# EAGLE design Scheme (EAGLE 9.6.2)
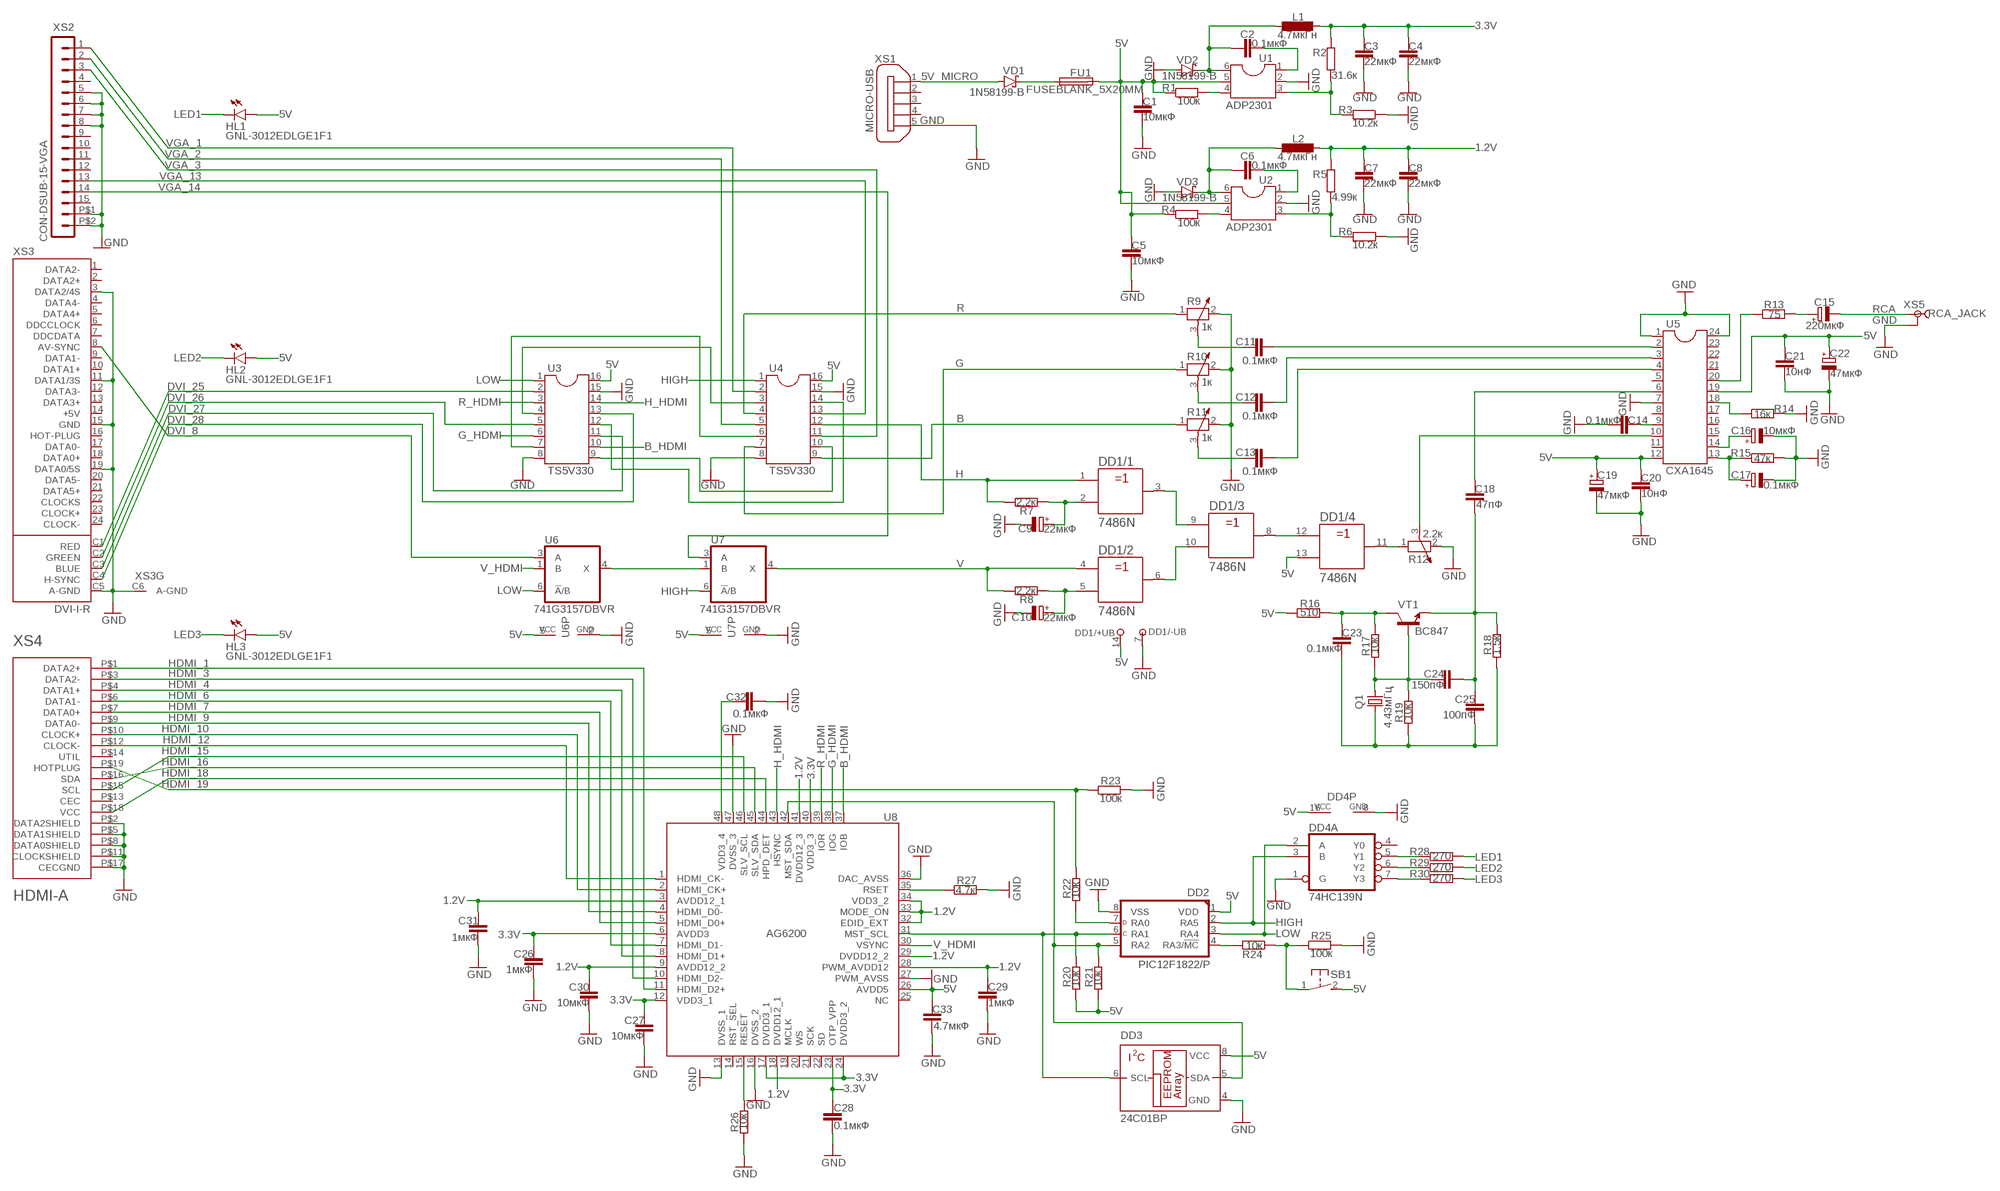
[diagram p0: schematic, sheet 1]

## Parts
C1  10мкФ  C-EUC0603  [C0603]
C2  0.1мкФ  C-EUC1206  [C1206]
C3  22мкФ  C-EUC1206  [C1206]
C4  22мкФ  C-EUC1206  [C1206]
C5  10мкФ  C-EUC0603  [C0603]
C6  0.1мкФ  C-EUC1206  [C1206]
C7  22мкФ  C-EUC1206  [C1206]
C8  22мкФ  C-EUC1206  [C1206]
C9  22мкФ  CPOL-EUE2,5-6E  [E2,5-6E]
C10  22мкФ  CPOL-EUE2,5-6E  [E2,5-6E]
C11  0.1мкФ  C-EUC1206  [C1206]
C12  0.1мкФ  C-EUC1206  [C1206]
C13  0.1мкФ  C-EUC1206  [C1206]
C14  0.1мкФ  C-EUC1206  [C1206]
C15  220мкФ  CPOL-EUE2,5-6E  [E2,5-6E]
C16  10мкФ  CPOL-EUE2,5-6E  [E2,5-6E]
C17  0.1мкФ  CPOL-EUE2,5-6E  [E2,5-6E]
C18  47пФ  C-EUC0603  [C0603]
C19  47мкФ  CPOL-EUE2,5-6E  [E2,5-6E]
C20  10нФ  C-EUC0603  [C0603]
C21  10нФ  C-EUC0603  [C0603]
C22  47мкФ  CPOL-EUE2,5-6E  [E2,5-6E]
C23  0.1мкФ  C-EUC1206  [C1206]
C24  150пФ  C-EUC0805  [C0805]
C25  100пФ  C-EUC0805  [C0805]
C26  1мкФ  C-EUC0603  [C0603]
C27  10мкФ  C-EUC0603  [C0603]
C28  0.1мкФ  C-EUC1206  [C1206]
C29  1мкФ  C-EUC0603  [C0603]
C30  10мкФ  C-EUC0603  [C0603]
C31  1мкФ  C-EUC0603  [C0603]
C32  0.1мкФ  C-EUC1206  [C1206]
C33  4.7мкФ  C-EUC0805  [C0805]
DD1  7486N  [DIL14]
DD2  PIC12F1822/P  [DIL8-P]
DD3  24C01BP  [DIL8]
DD4  74HC139N  [DIL16]
FU1  FUSEBLANK_5X20MM  [FUSE_HOLDER_5X20MM]
HL1  GNL-3012EDLGE1F1  [PLCC2]
HL2  GNL-3012EDLGE1F1  [PLCC2]
HL3  GNL-3012EDLGE1F1  [PLCC2]
L1  4.7мкГн  L-EUPIS2816  [PIS2816]
L2  4.7мкГн  L-EUPIS2816  [PIS2816]
Q1  4.43мГц  CRYSTALHC49U-V  [HC49U-V]
R1  100к  R-EU_R2512  [R2512]
R2  31.6к  R-EU_R0805  [R0805]
R3  10.2к  R-EU_R0805  [R0805]
R4  100к  R-EU_R2512  [R2512]
R5  4.99к  R-EU_R0805  [R0805]
R6  10.2к  R-EU_R0805  [R0805]
R7  2.2к  R-EU_R0402  [R0402]
R8  2.2к  R-EU_R0402  [R0402]
R9  1к  POTENTIOMETER_PT-10  [PT-10]
R10  1к  POTENTIOMETER_PT-10  [PT-10]
R11  1к  POTENTIOMETER_PT-10  [PT-10]
R12  2.2к  POTENTIOMETER_PT-10  [PT-10]
R13  75  R-EU_R0402  [R0402]
R14  16к  R-EU_R0402  [R0402]
R15  47к  R-EU_R0402  [R0402]
R16  510  R-EU_R0402  [R0402]
R17  10к  R-EU_R0805  [R0805]
R18  1.5к  R-EU_R0402  [R0402]
R19  10к  R-EU_R0805  [R0805]
R20  10к  R-EU_R0805  [R0805]
R21  10к  R-EU_R0805  [R0805]
R22  10к  R-EU_R0805  [R0805]
R23  100к  R-EU_R2512  [R2512]
R24  10к  R-EU_R0805  [R0805]
R25  100к  R-EU_R2512  [R2512]
R26  10к  R-EU_R0805  [R0805]
R27  4.7к  R-EU_R0402  [R0402]
R28  270  R-EU_R0402  [R0402]
R29  270  R-EU_R0402  [R0402]
R30  270  R-EU_R0402  [R0402]
SB1  31-XX  [B3F-31XX]
U1  ADP2301  DIL6  [DIL06]
U2  ADP2301  DIL6  [DIL06]
U3  TS5V330  DIL16  [DIL16]
U4  TS5V330  DIL16  [DIL16]
U5  CXA1645  DIL24-4  [DIL24-4]
U6  741G3157DBVR  [DBV_R-PDSO-G6]
U7  741G3157DBVR  [DBV_R-PDSO-G6]
U8  AG6200  [PLCC-48]
VD1  1N58199-B  [DO41-7.6]
VD2  1N58199-B  [DO41-7.6]
VD3  1N58199-B  [DO41-7.6]
VT1  BC847  BC847-NPN-SOT23-BEC  [SOT23-BEC]
XS1  MICRO-USB  [ZX62D-B-5PA8]
XS2  CON-DSUB-15-VGA  [181-015-212-171]
XS3  DVI-I-R  [DVI-I-R]
XS4  HDMI-A  [HDMI_A]
XS5  RCA_JACK  [TOBU3]

## Nets
1.2V: C7.1 C8.1 C29.1 C30.1 C31.1 L2.2 R5.2 U8.3(AVDD12_1) U8.9(AVDD12_2) U8.18(DVDD12_1) U8.28(PWM_AVDD12) U8.29(DVDD12_2) U8.32(EDID_EXT) U8.33(MODE_ON) U8.34(VDD3_2) U8.41(DVDD12_3)
3.3V: C3.1 C4.1 C26.1 C27.1 C28.1 L1.2 R2.2 U8.6(AVDD3) U8.12(VDD3_1) U8.17(DVDD3_1) U8.23(OTP_VPP) U8.24(DVDD3_2) U8.40(VDD3_3)
5V: C1.1 C5.1 C19.+ C20.1 C21.1 C22.+ C33.1 DD1.13(/4:B) DD1.14(/+UB:+UB) DD2.1(VDD) DD3.8(VCC) DD4.16(P:VCC) FU1.2 HL1.A HL2.A HL3.A R1.1 R4.1 R16.1 R20.1 R21.1 SB1.2(S) U1.5 U2.5 U3.16 U4.16 U5.12 U5.19 U6.5(VCC) U7.5(VCC) U8.26(AVDD5)
5V_MICRO: VD1.A XS1.1
B: R11.1 U4.9
B_HDMI: U3.10 U8.37(IOB)
DVI_8: U6.3(A) XS3.8(AV-SYNC)
DVI_25: U3.2 XS3.C1(RED)
DVI_26: U3.5 XS3.C2(GREEN)
DVI_27: U3.11 XS3.C3(BLUE)
DVI_28: U3.13 XS3.C4(H-SYNC)
G: R10.1 U4.7
G_HDMI: U3.6 U8.38(IOG)
GND: C1.2 C3.2 C4.2 C5.2 C7.2 C8.2 C9.- C10.- C14.2 C16.- C17.- C19.- C20.2 C21.2 C22.- C26.2 C27.2 C28.2 C29.2 C30.2 C31.2 C32.2 C33.2 DD1.7(/-UB:-UB) DD2.8(VSS) DD3.4(GND) DD4.1(A:G) DD4.8(P:GND) R3.1 R6.1 R9.2 R10.2 R11.2 R12.2 R14.2 R15.2 R23.2 R25.2 R26.1 R27.2 U1.2 U2.2 U3.8 U3.15 U4.8 U4.15 U5.1 U5.7 U5.24 U6.2(GND) U7.2(GND) U8.13(DVSS_1) U8.16(DVSS_2) U8.27(PWM_AVSS) U8.36(DAC_AVSS) U8.47(DVSS_3) VD2.A VD3.A XS1.5 XS2.5 XS2.6 XS2.7 XS2.8 XS2.P$1 XS2.P$2 XS3.3(DATA2/4S) XS3.11(DATA1/3S) XS3.15(GND) XS3.19(DATA0/5S) XS3.C5(A-GND) XS3.C6(A-GND) XS4.P$2(DATA2SHIELD) XS4.P$5(DATA1SHIELD) XS4.P$8(DATA0SHIELD) XS4.P$11(CLOCKSHIELD) XS4.P$17(CECGND) XS5.2 XS5.2@1 XS5.2@2
H: DD1.1(/1:A) R7.1 U4.12
H_HDMI: U3.14 U8.43(HSYNC)
HDMI_1: U8.11(HDMI_D2+) XS4.P$1(DATA2+)
HDMI_3: U8.10(HDMI_D2-) XS4.P$3(DATA2-)
HDMI_4: U8.8(HDMI_D1+) XS4.P$4(DATA1+)
HDMI_6: U8.7(HDMI_D1-) XS4.P$6(DATA1-)
HDMI_7: U8.5(HDMI_D0+) XS4.P$7(DATA0+)
HDMI_9: U8.4(HDMI_D0-) XS4.P$9(DATA0-)
HDMI_10: U8.2(HDMI_CK+) XS4.P$10(CLOCK+)
HDMI_12: U8.1(HDMI_CK-) XS4.P$12(CLOCK-)
HDMI_15: U8.46(SLV_SCL) XS4.P$15(SCL)
HDMI_16: U8.45(SLV_SDA) XS4.P$16(SDA)
HDMI_18: U8.44(HPD_DET) XS4.P$18(VCC)
HDMI_19: R22.2 R23.1 XS4.P$19(HOTPLUG)
HIGH: DD2.2(RA5) DD4.3(A:B) U4.1 U7.6(!A!/B)
LED1: HL1.C R28.2
LED2: HL2.C R29.2
LED3: HL3.C R30.2
LOW: DD2.3(RA4) DD4.2(A:A) U3.1 U6.6(!A!/B)
N$1: FU1.1 VD1.C
N$2: C9.+ DD1.2(/1:B) R7.2
N$3: C2.1 L1.1 U1.6 VD2.C
N$4: C10.+ DD1.5(/2:B) R8.2
N$5: C2.2 U1.1
N$6: R2.1 R3.2 U1.3
N$7: R1.2 U1.4
N$8: C6.1 L2.1 U2.6 VD3.C
N$9: C6.2 U2.1
N$10: R5.1 R6.2 U2.3
N$11: DD4.5(A:Y1) R28.1
N$12: R4.2 U2.4
N$13: C11.2 U5.2
N$14: DD1.3(/1:Y) DD1.9(/3:A)
N$15: DD1.6(/2:Y) DD1.10(/3:B)
N$16: C12.2 U5.3
N$17: DD1.8(/3:Y) DD1.12(/4:A)
N$18: DD1.11(/4:Y) R12.1
N$19: C11.1 R9.3
N$20: C12.1 R10.3
N$22: C13.1 R11.3
N$23: C13.2 U5.4
N$24: R12.3 U5.10
N$25: C23.1 R16.2 R17.2 VT1.C
N$26: C23.2 C25.2 Q1.2 R18.1 R19.1
N$27: C24.1 Q1.1 R17.1 R19.2 VT1.B
N$28: C18.2 C24.2 C25.1 R18.2 VT1.E
N$29: C18.1 U5.6
N$30: DD4.6(A:Y2) R29.1
N$31: C14.1 U5.9
N$32: DD4.7(A:Y3) R30.1
N$33: C17.+ R15.1 U5.13
N$34: C16.+ U5.14
N$35: R14.1 U5.18
N$36: R13.1 U5.20
N$37: U6.4(X) U7.1(B)
N$38: C15.+ R13.2
N$39: U3.4 U4.3
N$40: U3.7 U4.6
N$41: U3.9 U4.10
N$42: C32.1 U8.48(VDD3_4)
N$43: U3.12 U4.14
N$48: R26.2 U8.15(RESET)
N$49: R27.1 U8.35(RSET)
N$61: DD2.6(RA1) DD3.6(SCL) R20.2 U8.31(MST_SCL)
N$63: DD2.5(RA2) DD3.5(SDA) R21.2 U8.42(MST_SDA)
N$65: DD2.7(RA0) R22.1
N$68: DD2.4(RA3/!MC!) R24.2
N$69: R24.1 R25.1 SB1.1(P)
R: R9.1 U4.4
R_HDMI: U3.3 U8.39(IOR)
RCA: C15.- XS5.1
V: DD1.4(/2:A) R8.1 U7.4(X)
V_HDMI: U6.1(B) U8.30(VSYNC)
VGA_1: U4.2 XS2.1
VGA_2: U4.5 XS2.2
VGA_3: U4.11 XS2.3
VGA_13: U4.13 XS2.13
VGA_14: U7.3(A) XS2.14
Unconnected: DD4.4(A:Y0) DD4.9(B:Y3) DD4.10(B:Y2) DD4.11(B:Y1) DD4.12(B:Y0) DD4.13(B:B) DD4.14(B:A) DD4.15(B:G) U5.5 U5.8 U5.11 U5.15 U5.16 U5.17 U5.21 U5.22 U5.23 U8.14(RST_SEL) U8.19(MCLK) U8.20(WS) U8.21(SCK) U8.22(SD) U8.25(NC) XS1.2 XS1.3 XS1.4 XS1.S1 XS1.S2 XS1.S3 XS1.S4 XS2.4 XS2.9 XS2.10 XS2.11 XS2.12 XS2.15 XS3.1(DATA2-) XS3.2(DATA2+) XS3.4(DATA4-) XS3.5(DATA4+) XS3.6(DDCCLOCK) XS3.7(DDCDATA) XS3.9(DATA1-) XS3.10(DATA1+) XS3.12(DATA3-) XS3.13(DATA3+) XS3.16(HOT-PLUG) XS3.17(DATA0-) XS3.18(DATA0+) XS3.20(DATA5-) XS3.21(DATA5+) XS3.22(CLOCKS) XS3.23(CLOCK+) XS3.24(CLOCK-) XS4.P$13(CEC) XS4.P$14(UTIL)

## Power pins joined to a net without a drawn wire
+5V: XS3.14(+5V)

## Library data of the parts
C1-C8 C11-C14 C18 C20 C21 C23-C33 = kursach_final:C-EU: CAPACITOR, European symbol; SPICEPREFIX: C
C9 C10 C15-C17 C19 C22 = kursach_final:CPOL-EU: POLARIZED CAPACITOR, European symbol; SPICEPREFIX: C
DD1 = kursach_final:74*86: Quad 2-input EXCLUSIV-OR gate
DD2 = kursach_final:PIC12*F1822: Low pincount microcontroller http://www.microchip.com/wwwproducts/Devices.aspx?product=PIC12F1822 Properties Parameter Name Value Program Memory Type Flash Program Memory (KB) 3.5 CPU Speed (MIPS) 8 RAM Bytes 128 Data EEPROM (bytes) 256 Digital Communication Peripherals 1-UART, 1-A/E/USART, 1-SPI, 1-I2C1-MSSP(SPI/I2C) Capture/Compare/PWM Peripherals 1 ECCP / Timers 2 x 8-bit, 1 x 16-bit ADC 4 ch, 10-bit Comparators 1 Temperature Range (C) -40 to 125 Operating Voltage Range (V) 1.8 to 5.5 Pin Count 8 XLP Yes Cap Touch Channels 4 Features Enhanced Mid-range Core with 49 Instruction, 16 Stack Levels Flash Program Memory with self read/write capability Internal 32MHz oscillator Integrated Capacitive mTouch Sensing Module Data Signal Modulator Module MI2C, SPI, EUSART w/auto baud ECCP (Enhanced/Capture Compare PWM) Module Comparator with selectable Voltage Reference 4 Channel 10b ADC with Voltage Reference 25mA Source/Sink current I/O Two 8-bit Timers (TMR0/TMR2) One 16-bit Timer (TMR1) Extended Watchdog Timer (EWDT) Enhanced Power-On/Off-Reset Brown-Out Reset (BOR) In Circuit Serial Programming (ICSP) On Board In-Circuit Debug Wide Operating Voltage (1.8V – 5.5V) Low Power PIC12LF182x variants (1.8V – 3.6V) Standby Current (PIC12LF182X): 20 nA @ 1.8V, typical Active Current(PIC12LF1822): 50 uA/MHz @ 1.8V, typical Library from www.mikroelektroniikka.fi/lbr
DD3 = kursach_final:24C0*: Serial EEPROM 128 bit/1 K/2 K, I2C; MPN: AT24C01B-PU; OC_FARNELL: 1362637; OC_NEWARK: 50M3312
DD4 = kursach_final:74*139: Dual 2-line to 4-line DECODER/DEMULTIPLEXER
FU1 = kursach_final:FUSE: Fuse; OC_FARNELL: unknown; OC_NEWARK: unknown
HL1-HL3 = kursach_final:GNL-3012ED: LC TOPLED® Low Current LED Source: http://catalog.osram-os.com .. LG_LS_LY_T679_OBS.pdf; COLOR: green
L1 L2 = kursach_final:L-EU: INDUCTOR, European symbol; SPICEPREFIX: L
Q1 = kursach_final:CRYSTAL: CRYSTAL; OC_FARNELL: 1666969; OC_NEWARK: unknown
R1-R8 R13-R30 = kursach_final:R-EU_: RESISTOR, European symbol; SPICEPREFIX: R
R9-R12 = kursach_final:POTENTIOMETER_: Potentiometer; SPICEMODEL: POT; SPICEPREFIX: X
SB1 = kursach_final:31-XX: OMRON SWITCH; MPN: B3F-3100; OC_FARNELL: 959704; OC_NEWARK: 36M3582
U1 U2 = kursach_final:DIL6: Dual In Line / Socket
U3 U4 = kursach_final:DIL16: Dual In Line / Socket
U5 = kursach_final:DIL24: Dual In Line
U6 U7 = kursach_final:74*1G3157: Single-Pole, Double-Throw Analog Switch Source: http://focus.ti.com/lit/ds/symlink/sn74lvc1g3157.pdf
U8 = kursach_final:AG6200: ag6200; MPN: AD1953YSTZRL7; OC_FARNELL: unknown; OC_NEWARK: 12M8457
VD1-VD3 = kursach_final:1N5819: 1.0A SCHOTTKY BARRIER RECTIFIER Source: http://www.diodes.com/datasheets/ds23001.pdf
VT1 = kursach_final:*-NPN-: NPN Transistror
XS1 = kursach_final:MICRO-USB: Micro USB Type B Connector - Standard, Shell Through Hole Source: http://www.hirose.co.jp/cataloge_hp/ed_ZX_20140804.pdf; MF: Hirose; MPN: ZX62D-B-5PA8; OC_FARNELL: 2300438; OC_NEWARK: 69W0712
XS2 = kursach_final:CON-DSUB-15-VGA: NORCOMP's High Density 90° PC Mount D-Sub Connector 181 Series: SPECIFICATIONS: Contact Rating: 5 Amps Dielectric Strength: 1000V AC RMS Insulation Resistance: 1000 meg ohms Contact Material: Phosphor Bronze Contact Finish: Gold flash over Nickel Operating Temperature: -55°C to 150°C Shell Material: Steel, Tin Plated Insulations Material: Glass-Filled Polyester (UL94V-0) Gender: Receptacle (female) Please send any comments to: messi@users.sourceforge.net
XS3 = kursach_final:DVI-I-R: CONNECTOR MiroCross(TM)-DVI i/0 plug and receptacle connector system (scart)
XS4 = kursach_final:HDMI-A: Horizonal HDMI type "A" jack
XS5 = kursach_final:RCA_JACK: Female Cinch CONNECTOR ( RCA Jack ); MF: FARNELL; MPN: TOBU 3; OC_FARNELL: 592791; OC_NEWARK: 06WX5914

## Board
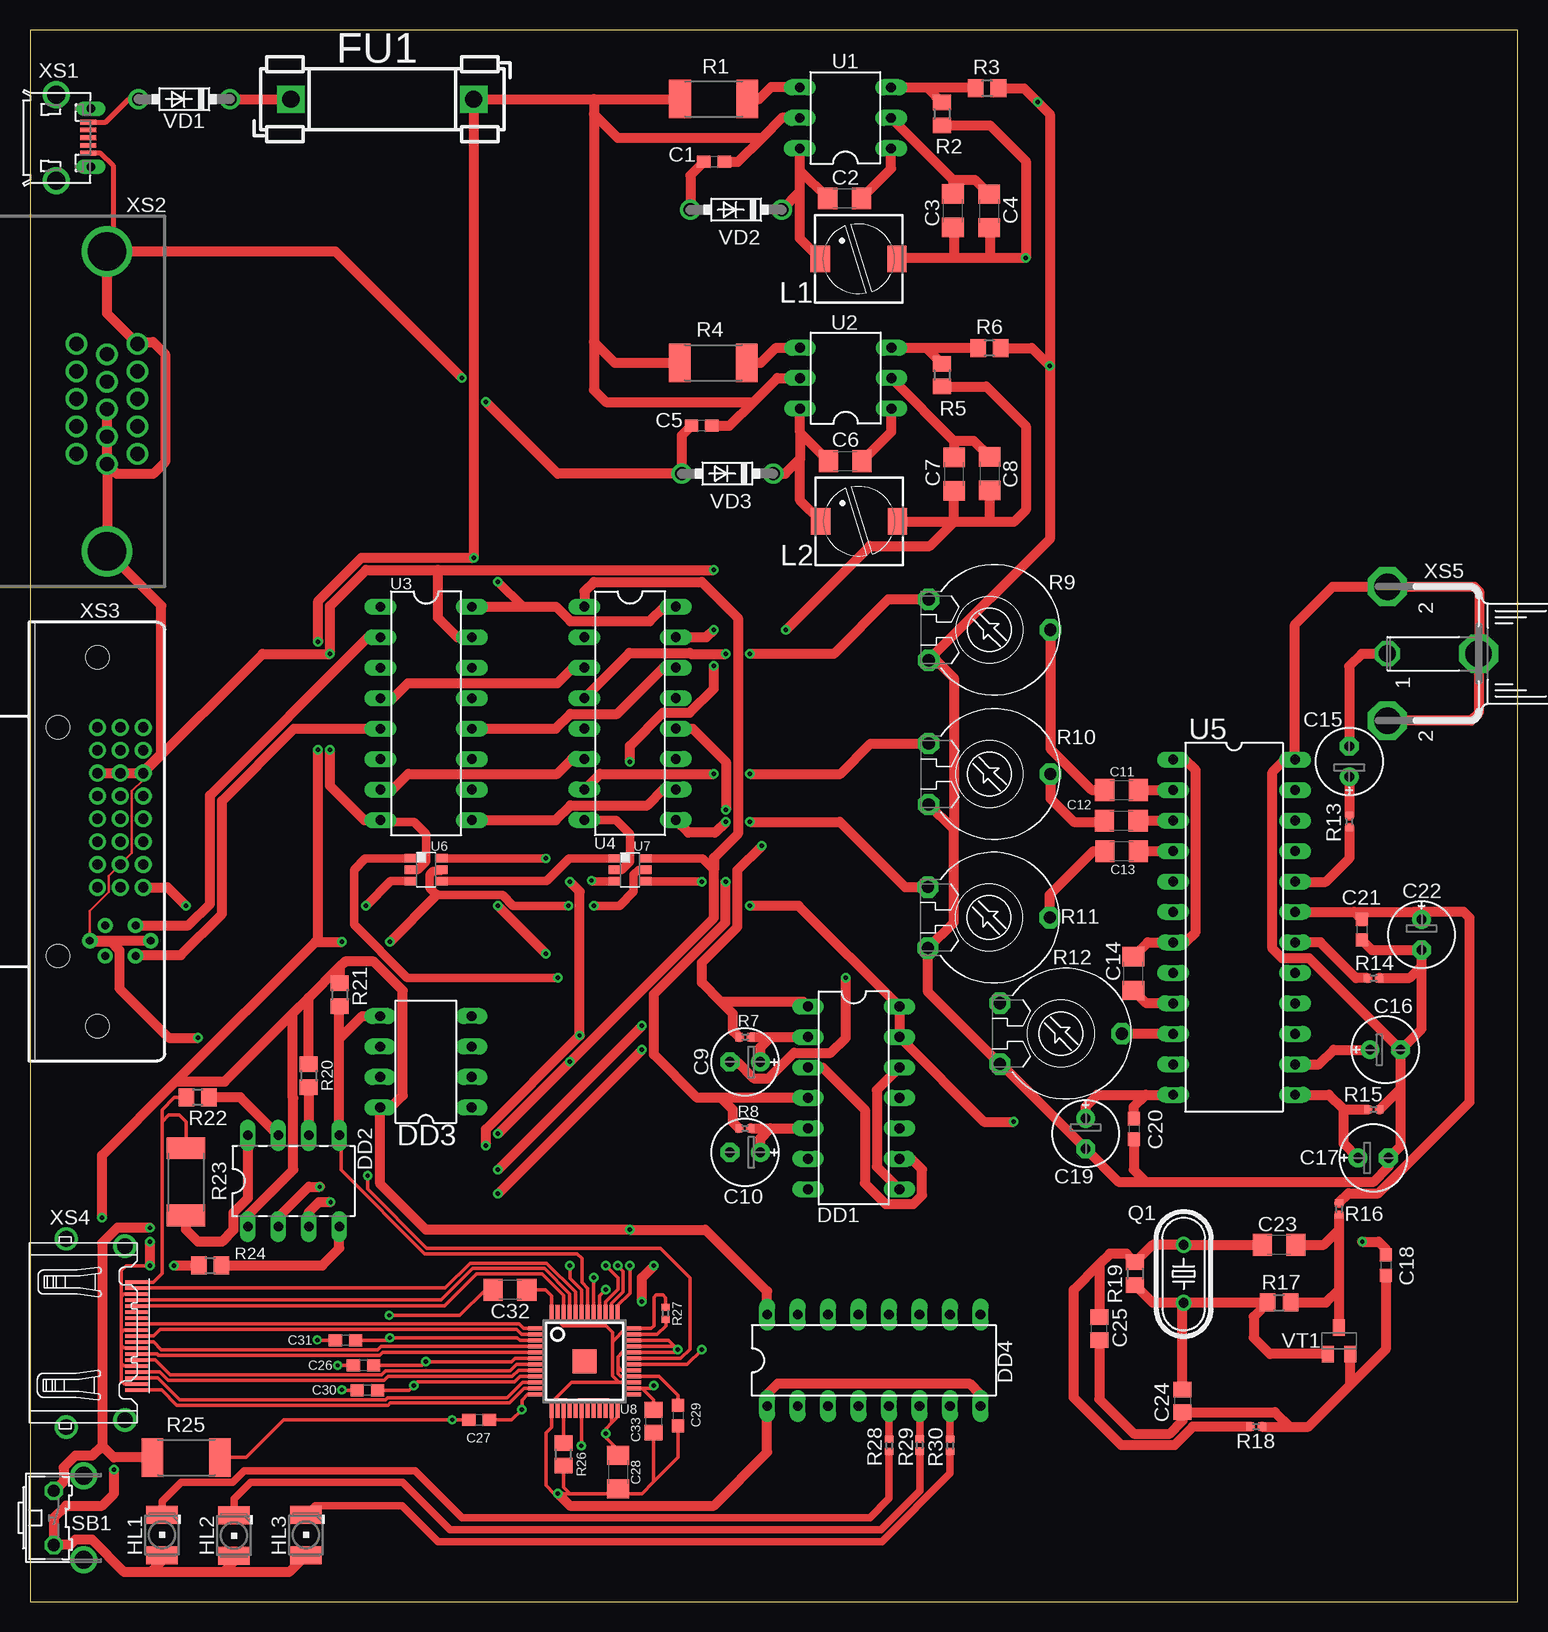
[diagram p1: board, top side]
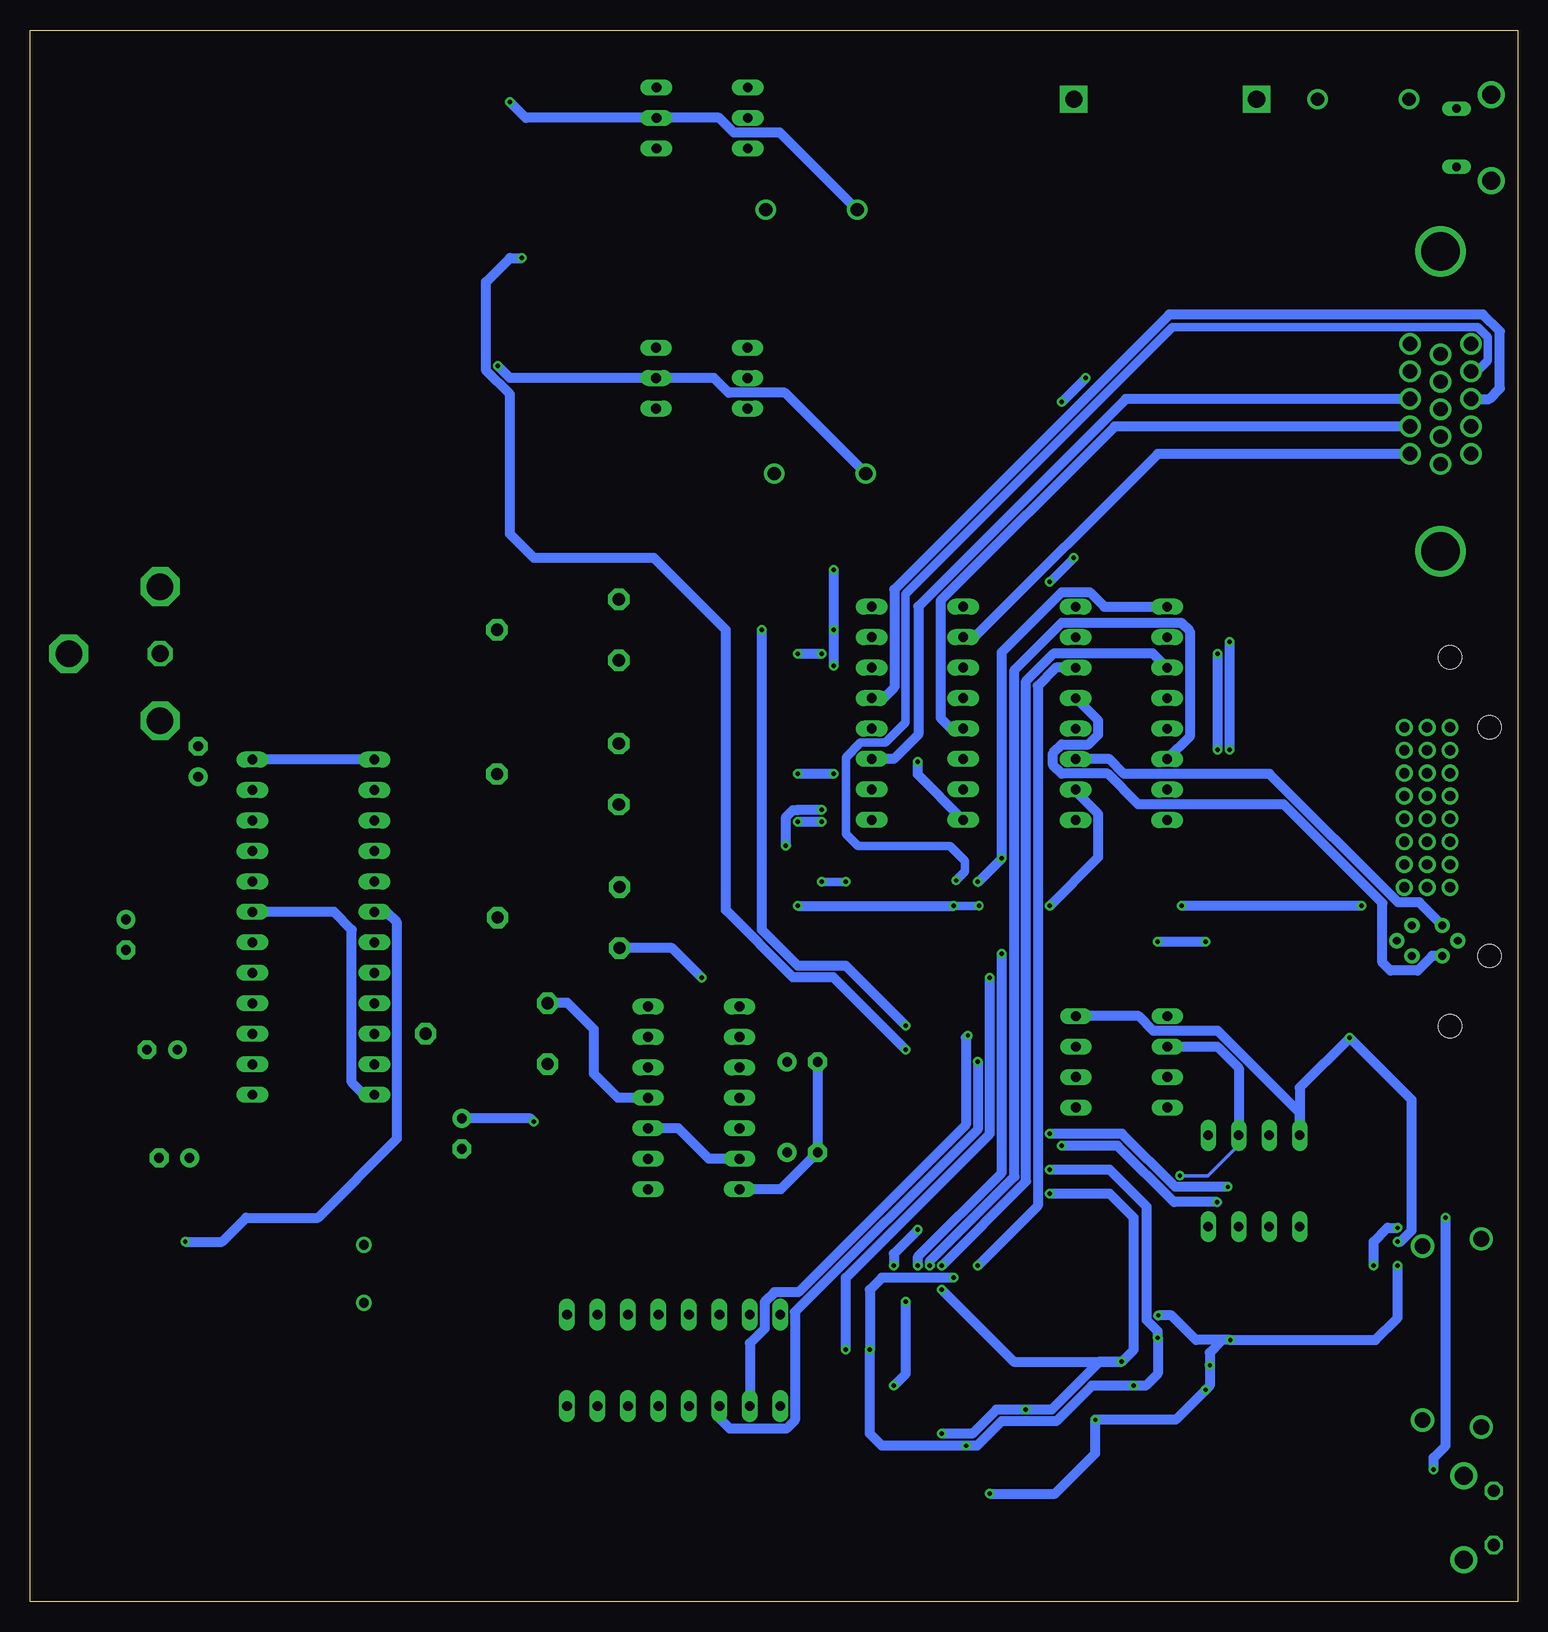
[diagram p2: board, bottom side, seen from below]

Size 124 x 131 mm. Coordinates in mm from the lower left corner, seen from the top.
Outline: 0,0 124,0 124,131 0,131 0,0
Copper layers (1*16): Top 0.035mm / dielectric 1.5mm / Bottom 0.035mm
Design rules "default": minimum track width 6mil, minimum drill 0.35mm, track to track 6mil, track to pad 6mil, pad to pad 6mil, via to via 6mil, smd to smd 6mil, copper to edge 40mil, drill to drill 6mil, minimum pad ring 10mil, minimum via ring 8mil, stop-mask expansion 4mil, vias tented up to drill 0mil, thermal gap 10mil

### Footprints (pad centres in the part's own frame; a part is rotated, then mirrored left to right if it is on the bottom)
C0603 = smd 1.1 x 1: 1 -0.85,0; 2 0.85,0
C1206 = smd 1.6 x 1.8: 1 -1.4,0; 2 1.4,0
E2,5-6E = drill 0.813 pad 1.575: + -1.27,0 | drill 0.813 pad 1.575 octagon: - 1.27,0
C0805 = smd 1.3 x 1.5: 1 -0.95,0; 2 0.95,0
DIL14 = drill 0.813 long: 1 -7.62,-3.81; 2 -5.08,-3.81; 3 -2.54,-3.81; 4 0,-3.81; 5 2.54,-3.81; 6 5.08,-3.81; 7 7.62,-3.81; 8 7.62,3.81; 9 5.08,3.81; 10 2.54,3.81; 11 0,3.81; 12 -2.54,3.81; 13 -5.08,3.81; 14 -7.62,3.81
DIL8-P = drill 0.8 pad 1.3 long: 1 -3.81,-3.81; 2 -1.27,-3.81; 3 1.27,-3.81; 4 3.81,-3.81; 5 3.81,3.81; 6 1.27,3.81; 7 -1.27,3.81; 8 -3.81,3.81
DIL8 = drill 0.813 long: 1 -3.81,-3.81; 2 -1.27,-3.81; 3 1.27,-3.81; 4 3.81,-3.81; 5 3.81,3.81; 6 1.27,3.81; 7 -1.27,3.81; 8 -3.81,3.81
DIL16 = drill 0.813 long: 1 -8.89,-3.81; 2 -6.35,-3.81; 3 -3.81,-3.81; 4 -1.27,-3.81; 5 1.27,-3.81; 6 3.81,-3.81; 7 6.35,-3.81; 8 8.89,-3.81; 9 8.89,3.81; 10 6.35,3.81; 11 3.81,3.81; 12 1.27,3.81; 13 -1.27,3.81; 14 -3.81,3.81; 15 -6.35,3.81; 16 -8.89,3.81
FUSE_HOLDER_5X20MM = drill 1.422 pad 2.286 square: 1 0,0; 2 15.24,0
PLCC2 = smd 2.6 x 1.5: A 0,1.7; C 0,-1.7
PIS2816 = smd 2.2 x 1.6: 1 0,3.2; 2 0,-3.2
HC49U-V = drill 0.813: 1 -2.413,0; 2 2.413,0
R2512 = smd 1.8 x 3.2: 1 -2.8,0; 2 2.8,0
R0805 = smd 1.3 x 1.5: 1 -0.95,0; 2 0.95,0
R0402 = smd 0.6 x 0.7: 1 -0.5,0; 2 0.5,0
PT-10 = drill 1.016 pad 1.778 octagon: 1 -2.54,-5.08; 2 2.54,-5.08; 3 0,5.08
B3F-31XX = drill 1.016 octagon: 1 -2.261,-1.245; 2 2.261,-1.245 | drill 1.499 pad 2.159: 3 -3.505,1.245; 4 3.505,1.245
DIL06 = drill 0.813 long: 1 -2.54,-3.81; 2 0,-3.81; 3 2.54,-3.81; 4 2.54,3.81; 5 0,3.81; 6 -2.54,3.81
DIL24-4 = drill 0.813 long: 1 -13.97,-5.08; 2 -11.43,-5.08; 3 -8.89,-5.08; 4 -6.35,-5.08; 5 -3.81,-5.08; 6 -1.27,-5.08; 7 1.27,-5.08; 8 3.81,-5.08; 9 6.35,-5.08; 10 8.89,-5.08; 11 11.43,-5.08; 12 13.97,-5.08; 13 13.97,5.08; 14 11.43,5.08; 15 8.89,5.08; 16 6.35,5.08; 17 3.81,5.08; 18 1.27,5.08; 19 -1.27,5.08; 20 -3.81,5.08; 21 -6.35,5.08; 22 -8.89,5.08; 23 -11.43,5.08; 24 -13.97,5.08
DBV_R-PDSO-G6 = smd 0.69 x 0.99: 1 -0.95,-1.29; 2 0,-1.29; 3 0.95,-1.29; 4 0.95,1.3; 5 0,1.3; 6 -0.95,1.3
PLCC-48 = smd 0.3 x 1.2: 1 -2.75,-4.1; 2 -2.25,-4.1; 3 -1.75,-4.1; 4 -1.25,-4.1; 5 -0.75,-4.1; 6 -0.25,-4.1; 7 0.25,-4.1; 8 0.75,-4.1; 9 1.25,-4.1; 10 1.75,-4.1; 11 2.25,-4.1; 12 2.75,-4.1; 25 2.75,4.1; 26 2.25,4.1; 27 1.75,4.1; 28 1.25,4.1; 29 0.75,4.1; 30 0.25,4.1; 31 -0.25,4.1; 32 -0.75,4.1; 33 -1.25,4.1; 34 -1.75,4.1; 35 -2.25,4.1; 36 -2.75,4.1 | smd 1.2 x 0.3: 13 4.1,-2.75; 14 4.1,-2.25; 15 4.1,-1.75; 16 4.1,-1.25; 17 4.1,-0.75; 18 4.1,-0.25; 19 4.1,0.25; 20 4.1,0.75; 21 4.1,1.25; 22 4.1,1.75; 23 4.1,2.25; 24 4.1,2.75; 37 -4.1,2.75; 38 -4.1,2.25; 39 -4.1,1.75; 40 -4.1,1.25; 41 -4.1,0.75; 42 -4.1,0.25; 43 -4.1,-0.25; 44 -4.1,-0.75; 45 -4.1,-1.25; 46 -4.1,-1.75; 47 -4.1,-2.25; 48 -4.1,-2.75 | smd 2 x 2: EXP 0,0
DO41-7.6 = drill 1.1 pad 1.7: A 3.81,0; C -3.81,0
SOT23-BEC = smd 1 x 1.4: B -0.95,-1.1; C 0,1.1; E 0.95,-1.1
ZX62D-B-5PA8 = smd 1.35 x 0.4: 1 4.825,1.3; 2 4.825,0.65; 3 4.825,0; 4 4.825,-0.65; 5 4.825,-1.3 | drill 1.5: S1 2.15,-3.6; S2 2.15,3.6 | drill 0.7 long: S3 5.05,2.425; S4 5.05,-2.425
181-015-212-171 = drill 1.194: 1 4.371,2.541; 2 2.08,2.541; 3 -0.211,2.541; 4 -2.502,2.541; 5 -4.793,2.541; 6 5.217,0; 7 2.926,0; 8 0.635,0; 9 -1.656,0; 10 -3.947,0; 11 4.371,-2.541; 12 2.08,-2.541; 13 -0.211,-2.541; 14 -2.502,-2.541; 15 -4.793,-2.541 | drill 3.2: P$1 -12.502,0; P$2 12.502,0
DVI-I-R = drill 0.864 pad 1.397: 1 -9.525,6.985; 2 -7.62,6.985; 3 -5.715,6.985; 4 -3.81,6.985; 5 -1.905,6.985; 6 0,6.985; 7 1.905,6.985; 8 3.81,6.985; 9 -9.525,5.08; 10 -7.62,5.08; 11 -5.715,5.08; 12 -3.81,5.08; 13 -1.905,5.08; 14 0,5.08; 15 1.905,5.08; 16 3.81,5.08; 17 -9.525,3.175; 18 -7.62,3.175; 19 -5.715,3.175; 20 -3.81,3.175; 21 -1.905,3.175; 22 0,3.175; 23 1.905,3.175; 24 3.81,3.175 | drill 0.66 pad 1.27: C1 6.985,6.35; C2 9.525,6.35; C3 6.985,3.81; C4 9.525,3.81; C5 8.255,2.54; C6 8.255,7.62 | hole 1.93: -15.367,3.175; 15.367,3.175; -9.525,-0.127; 9.525,-0.127
HDMI_A = smd 0.3 x 1.9: P$1 4.75,3.95; P$2 4.25,3.95; P$3 3.75,3.95; P$4 3.25,3.95; P$5 2.75,3.95; P$6 2.25,3.95; P$7 1.75,3.95; P$8 1.25,3.95; P$9 0.75,3.95; P$10 0.25,3.95; P$11 -0.25,3.95; P$12 -0.75,3.95; P$13 -1.25,3.95; P$14 -1.75,3.95; P$15 -2.25,3.95; P$16 -2.75,3.95; P$17 -3.25,3.95; P$18 -3.75,3.95; P$19 -4.25,3.95 | drill 1.3: P$20 -7.25,3; P$21 7.25,3; P$22 7.85,-1.9; P$23 -7.85,-1.9
TOBU3 = drill 1.397 octagon: 1 0,-2.54 | drill 2.21 octagon: 2 5.588,-2.54; 2@1 -5.588,-2.54; 2@2 0,5.08

### Placement (x,y rotation side)
C1  57.02,120.01 180 top
C2  67.9,116.97 0 top
C3  76.94,115.94 90 top
C4  79.97,115.91 90 top
C5  55.99,98.01 180 top
C6  67.96,95.06 0 top
C7  77.04,93.98 90 top
C8  80.01,94.02 90 top
C9  59.61,44.97 180 top
C10  59.61,37.44 180 top
C11  90.99,67.65 0 top
C12  90.97,65.1 0 top
C13  91,62.55 0 top
C14  91.98,52.35 90 top
C15  109.97,70.02 90 top
C16  112.98,46 0 top
C17  111.97,36.98 0 top
C18  113.02,28.05 270 top
C19  88,39 270 top
C20  92.02,39.4 270 top
C21  111.02,56 270 top
C22  116,55.58 270 top
C23  104.12,29.73 180 top
C24  96.07,16.73 270 top
C25  89.13,22.75 90 top
C26  27.8,19.68 180 top
C27  37.44,15.13 180 top
C28  49.02,10.79 270 top
C29  54.02,15.5 270 top
C30  28.12,17.62 180 top
C31  26.3,21.78 180 top
C32  40.01,25.98 180 top
C33  51.97,15.03 270 top
DD1  68.67,41.98 270 top
DD2  21.97,35.05 0 top
DD3  33,44.99 90 top
DD4  70.34,20.1 0 top
FU1  21.75,125.23 0 top
HL1  11,5.55 180 top
HL2  17,5.5 180 top
HL3  23,5.55 180 top
L1  69.07,111.93 90 top
L2  69.12,90.05 90 top
Q1  96.17,27.31 90 top
R1  56.99,125.25 0 top
R2  76.02,124 270 top
R3  79.78,126.13 180 top
R4  56.95,103.26 0 top
R5  76.02,102.23 270 top
R6  79.98,104.48 180 top
R7  59.61,47.05 0 top
R8  59.6,39.44 0 top
R9  79.99,81 270 top
R10  79.99,68.98 270 top
R11  79.94,57.01 270 top
R12  85.94,47.34 270 top
R13  109.98,65.02 90 top
R14  111.99,51.97 0 top
R15  112.01,41.02 0 top
R16  109.12,32.72 270 top
R17  104.12,24.92 0 top
R18  102.2,14.57 0 top
R19  92.12,27.33 270 top
R20  23.22,43.83 270 top
R21  25.82,50.58 270 top
R22  13.98,42.03 180 top
R23  13.01,34.99 270 top
R24  15.02,28.02 0 top
R25  13.02,12.01 0 top
R26  44.48,12.27 90 top
R27  52.98,24.02 90 top
R28  71.62,13.01 270 top
R29  74.17,13.04 270 top
R30  76.7,13.01 270 top
SB1  3.23,6.97 270 top
U1  67.97,123.67 90 top
U2  68,101.98 90 top
U3  33.02,74.03 270 top
U4  50.02,74.04 270 top
U5  100.37,56.21 270 top
U6  33.01,61 270 top
U7  50.01,60.99 270 top
U8  46.23,20.02 270 top
VD1  12.86,125.23 180 top
VD2  58.86,116.02 180 top
VD3  58.14,94.02 180 top
VT1  109.12,21.73 0 top
XS1  0.03,122.02 0 top
XS2  6.42,100.03 270 top
XS3  2.45,63.34 270 top
XS4  4.92,22.38 270 top
XS5  115.69,79.01 270 top

### Tracks (layer width: path | path; a pad name or v marks a point on that pad's centre or on a via)
1.2V  (via drill 0.35)
  Top 0.3: U8.3 40.84,21.77 40.62,21.99 v30,21.99 29.79,21.78 C31.1 | U8.9 40.85,18.77 40.39,18.31 32.31,18.31 v32,18 31.62,17.62 C30.1 | U8.18 45.98,13.01 v45.96,12.99 | C29.1 54.02,17.2 52.45,18.77 U8.28 49.23,18.77 49,19 49,19.55 | U8.34 53.23,21.77 v54,21 | U8.33 53.73,21.27 v54,21 | v54,21 53.77,20.77 U8.32 49.37,20.77 49,20.4 49,19.55 | U8.29 49.28,19.27 49,19.55 | U8.41 46.98,26.98 v47,27
  Top 0.813: R5.2 79.72,101.28 83,98 83,91 82,90 80,90 | 80,90 77,90 | 77,90 72.37,90 L2.2 | 77,90 77,92.54 C7.1 | 80,90 C8.1 | v39,36 v51,48 | v63,81 70,88 75,88 77,90
  Bottom 0.813: v47,27 53,27 54,26 v54,21 54,14 53,13 v45.97,13 v45.96,12.99 45.06,12.99 43.01,15.04 38.45,15.04 35.48,18 v32,18 31,18 30,19 v30,21.99 30,22.54 30.91,23.45 30.91,32.91 34,36 v39,36 | v51,48 56,53 60,53 63,56 v63,81
3.3V  (via drill 0.35)
  Top 0.3: U8.6 40.43,20.27 40.16,20 v33,20 32.68,19.68 C26.1 | U8.12 41.48,17.27 41,16.79 v41,16 40.13,15.13 C27.1 | U8.24 48.98,15.38 48.48,14.88 | 48.48,14.88 48,14.4 v48,14 48,13.66 49.02,12.64 C28.1 | 48.48,14.88 U8.23 48.48,16.59 48.26,16.82 45.7,16.82 45.48,16.59 U8.17 | U8.40 47.48,25.48 v48,26
  Top 0.813: L1.2 72.34,112 77,112 | 80,112 v83,112 83,120.07 80.02,123.05 R2.2 | 80,112 77,112 | C3.1 77,114.48 77,112 | C4.1 80,114.48 80,112 | v39,34 v51,46
  Bottom 0.813: v33,20 34.85,20 38.85,16 v41,16 43.45,16 45.45,14 v48,14 | v48,26 42,20 v33,20 | v33,20 32,21 32,32 34,34 v39,34 | v51,46 57.03,52.03 60.4,52.03 66,57.63 66,81 72,87 82,87 84,89 84,100.64 85.97,102.6 85.97,109.97 86,110 84,112 v83,112
5V  (via drill 0.35)
  Top 0.3: C33.1 51.97,16.81 51.01,17.77 U8.26 51.77,17.77 v52,18
  Top 0.7: v44.88,58 40.28,58 39.38,58.91 33.9,58.91 33.31,59.5 33.31,60.6 33.61,60.9 34.21,60.9 U6.5 | v47,58 49.13,58 50.31,59.18 50.31,60.59 50.71,60.99 U7.5 | 41.1,82.92 39.02,85 v39,85
  Top 0.813: 47,125.25 37.01,125.25 FU1.2 v36.99,87.01 | 47,125.25 R1.1 | U1.5 62.67,123.67 61,122 | C1.1 59.01,120.01 61,122 | 47,125.25 47,124 | 61,122 49,122 47,124 | 47,124 47,105 | 47,105 48.74,103.26 R4.1 | 47,105 47,101 48,100 60.3,100 | 60.3,100 62.3,102 64.17,102 U2.5 | C5.1 58.31,98.01 60.3,100 | U5.19 110.39,57.48 | 110.39,57.48 C21.1 | 110.39,57.48 115.37,57.48 | 115.37,57.48 C22.+ | C19.+ 88,41.27 88.97,42.24 93,42.24 | 93,42.24 U5.12 | C20.1 92.02,41.26 93,42.24 | 25.82,52.92 26.25,53.35 28.65,53.35 31.07,50.93 31.07,42.17 30.08,41.18 DD3.8 29.19,34.81 33,31 v50,31 56.31,31 61.45,25.86 DD4.16 | 25.82,52.92 R21.1 | R20.1 23.22,50.32 | 23.22,50.32 25.82,52.92 | DD2.1 18.16,32.19 21.95,35.98 21.95,41.96 21.91,42 21.91,49.01 | 21.91,49.01 23.22,50.32 | v51,25 51,27 v52,28 | U3.16 41.1,82.92 43.84,82.92 45.05,81.71 51.66,81.71 52.88,82.93 U4.16 | R16.1 109.94,34.03 112.4,34.03 120,41.63 120,57 119.52,57.48 115.37,57.48 | HL3.A 21.6,2.45 16.1,2.45 | 16.1,2.45 10.05,2.45 | 10.05,2.45 7.87,2.45 5.17,5.15 3.78,5.15 3.34,4.71 SB1.2 1.99,6.99 3,8 6,8 7,9 v7,11 | HL1.A 11,3.4 10.05,2.45 | HL2.A 17,3.35 16.1,2.45 | v36.99,87.01 v37,87 | 21.91,49.01 16.24,43.34 12.15,43.34 | v6,32 6,37.19 12.15,43.34 | 12.15,43.34 23.81,55 | 23.81,55 v26,55 | v30,55 33.9,58.9 33.9,58.91 | 23.81,55 24,55.19 v24,71 | v24,80 24.04,80.03 24.04,83.4 27.64,87.01 v36.99,87.01 | v60,58 64.08,58 DD1.14 DD1.13 79.54,40 v82,40
  Bottom 0.7: v44.88,58 v47,58 | v39,85 v37,87
  Bottom 0.813: U5.12 96.14,42.24 97.17,43.27 97.17,56 98.65,57.48 U5.19 | v52,18 51,19 v51,25 | v7,11 7,12 6,13 v6,32 | v50,31 52,29 v52,28 | v26,55 v30,55 | v24,71 v24,80 | v60,58 v47,58 | v82,40 82.27,40.27 C19.+
5V_MICRO
  Top 0.4: XS1.1 6.32,123.32 8.23,125.23 VD1.A
B  (via drill 0.35)
  Top 0.813: U4.9 54.88,64.1 57.1,64.1 v58,65 | R11.1 72.95,59.55 67.5,65 v60,65
  Bottom 0.813: v58,65 v60,65
B_HDMI  (via drill 0.35)
  Top 0.3: U8.37 48.98,24.67 50,25.69 v50,28
  Top 0.813: v43,54 v39,58
  Bottom 0.813: v50,28 49.97,28.04 49.97,28.77 43,35.73 v43,54 | U3.10 36.83,67.53 34.95,65.64 34.95,62.05 v39,58
DVI_8  (via drill 0.35)
  Top 0.7: v28,58 30.05,60.05 U6.3
  Top 0.813: XS3.8 11.47,59.53 v13,58
  Bottom 0.813: v13,58 v28,58
DVI_25
  Top 0.813: XS3.C1 13.2,56.35 15,58.16 15,67.2 28.18,80.38 U3.2
DVI_26
  Top 0.813: XS3.C2 8.88,53.89 12.56,53.89 16,57.33 16,66.75 22.01,72.76 U3.5
DVI_27
  Bottom 0.813: XS3.C3 8.18,58.27 9.96,58.27 20.68,69 32.8,69 34.02,70.22 U3.11
DVI_28
  Bottom 0.813: XS3.C4 7.11,53.81 8.33,52.6 10.6,52.6 11.26,53.26 11.26,58.22 19.51,66.46 31.63,66.46 34.17,69 37.99,69 38.71,69.72 38.71,70.72 37.99,71.44 35.77,71.44 34.95,72.25 34.95,73.42 U3.13
G  (via drill 0.35)
  Top 0.813: U4.7 47.52,69 v57,69 | R10.1 70.07,71.52 67.55,69 v60,69
  Bottom 0.813: v57,69 v60,69
G_HDMI  (via drill 0.35)
  Top 0.3: U8.38 48.48,24.86 49.45,25.83 49.45,27.54 v49,27.99 v49,28
  Bottom 0.813: v49,28 48.97,28.04 48.97,28.4 41.93,35.44 41.93,77.66 37.99,81.6 28.05,81.6 27.33,80.89 27.33,72.1 U3.6
GND  (via drill 0.35)
  Top 0.2: XS3.3 9.44,68.5 8.48,67.54 8.48,62.39 XS3.15 6.58,60.48 6.58,59.14 4.99,57.55 XS3.C5
  Top 0.3: C31.2 23.97,21.78 v23.95,21.8 | C26.2 25.67,19.68 v25.65,19.7 | C30.2 26.03,17.62 v26,17.65 | C27.2 35.22,15.13 v35.2,15.15 21.15,15.15 18.01,12.01 R25.2 | 7.62,21.36 7.84,21.13 XS4.P$8 | 7.62,22.41 7.84,22.63 XS4.P$11 | 7.62,22.41 7.62,21.36 | 7.62,25.41 7.84,25.63 XS4.P$17 | 7.62,22.41 7.62,25.41 | 7.62,19.86 7.84,19.63 XS4.P$5 | 7.62,21.36 7.62,19.86 | XS4.P$2 7.84,18.13 7.62,18.36 7.62,19.86 | v10,28 8,28 7.62,27.62 7.62,25.41 | 45,9 v44,9 43.7,9 43,9.7 43,14.05 43.48,14.53 U8.13 43.48,16.59 43.7,16.82 | R26.1 44.48,9.52 45,9 | 43.7,16.82 44.76,16.82 44.98,16.59 U8.16 | C28.2 49.02,9.19 48.83,9 | 48.83,9 45,9 | 43.7,16.82 45.16,18.27 49,18.27 | U8.27 49,18.27 | C33.2 51.97,9.97 | 51.97,9.97 51,9 48.83,9 | C29.2 54.02,12.02 51.97,9.97 | 49,18.27 49,18.36 48.55,18.81 48.55,21.66 | 48.55,21.66 49.66,22.77 U8.36 51.77,22.77 52,23 52,25.35 52.2,25.55 52.75,25.55 52.98,25.32 R27.2 | C32.2 37.96,25.98 35.83,23.85 v29.95,23.85 | U8.47 43.98,23.45 44.42,23 48,23 48.55,22.45 48.55,21.66
  Top 0.406: XS1.5 5.91,120.72 6.92,119.72 6.92,113.03 XS2.P$1
  Top 0.7: U3.8 29.35,65 32,65 33,64 33,61.68 32.32,61 U6.2 | U4.8 48.85,65.15 50,64 50,61.67 49.32,60.99 U7.2
  Top 0.813: R3.1 82.87,126.13 v84,125 85,124 v85,103 | C5.2 54.33,97.2 VD3.A 43.98,94.02 v38,100 | C1.2 55.05,118.89 VD2.A | U2.2 77.04,96.75 | 77.04,96.75 C7.2 | C8.2 78.68,96.75 77.04,96.75 | U1.2 76.94,118.51 | 76.94,118.51 C3.2 | 76.94,118.51 78.77,118.51 C4.2 | R6.1 83.52,104.48 v85,103 | C21.2 111.86,54.31 C22.- | R14.2 112.52,52 115,52 116,53 C22.- | R15.2 114.25,42.76 | 114.25,42.76 C16.- | 114.25,42.76 114.25,37.99 C17.- 113.24,36.24 112,35 93,35 | C16.- 116,47.75 C22.- | C16.- 106.63,53.62 104.39,53.62 103.57,54.44 103.57,69.14 104.61,70.18 U5.24 105.45,81.45 108.6,84.6 XS5.2@1 120.4,84.6 120.8,84.2 120.8,79.04 XS5.2@2 120.77,74.07 120.12,73.42 XS5.2 | 93,35 90.73,35 C19.- 80.93,44.8 R12.2 74.86,50.8 R11.2 77,56.61 77,64.35 | C20.2 92.02,35.98 93,35 | U5.1 96.29,70.18 97.17,69.3 97.17,55.82 96.29,54.94 U5.7 93.17,54.94 C14.2 | DD2.8 18.16,33.61 16.95,32.4 16.95,30.95 16,30 14,30 13.01,30.99 R23.2 | XS2.6 7.23,94 10.25,94 11.25,95 11.25,104 10.25,105 9.14,105 XS2.5 6.42,107.36 XS2.P$1 25.47,112.53 v36,102 | XS2.6 XS2.7 XS2.8 | XS2.6 XS2.P$2 10.94,83.01 10.94,70.69 9.44,69.18 XS3.3 | XS3.19 XS3.11 XS3.3 | XS3.C6 XS3.C5 5.07,55.01 6.75,55.01 7.45,54.31 7.45,51.12 11.58,47 v14,47 | U4.15 56.39,80.39 v57,81 | U3.15 35.62,80.38 34,82 34,86 | U3.8 27.86,65.14 25,68 v25,71 | 34,86 28,86 25,83 v25,79 19.38,79 XS3.3 | v50,70 50,71.33 52.77,74.09 54.99,74.09 57,76.09 v57,78 | 34,86 v57,86 | DD4.8 79.23,17.23 78.3,18.17 62.34,18.17 61.45,17.29 DD4.1 61.45,12.45 57,8 45,8 v44,9 | 77,64.35 R10.2 | 77,64.35 77,77 75.54,78.46 R9.2 85,88.55 v85,103 | v10,28 v10,30 | C9.- 58.98,44.97 60.32,43.62 61.58,43.62 63.7,45.74 66.74,45.74 68,47 v68,52
  Bottom 0.813: VD2.A 61.48,122.45 65.33,122.45 66.55,123.67 U1.2 82.67,123.67 v84,125 | VD3.A 61.07,100.76 65.76,100.76 67,102 71.79,102 U2.2 83.98,101.98 v85,103 | U5.1 U5.24 | v23.95,21.8 24.6,21.8 25.65,20.75 v25.65,19.7 25.65,18 v26,17.65 28.5,15.15 v35.2,15.15 35.2,12.35 38.55,9 v44,9 | v23.95,21.8 11.85,21.8 10,23.65 v10,28 | v23.95,21.8 26.8,21.8 28.85,23.85 v29.95,23.85 | DD3.4 31.57,48.8 30.36,47.58 25,47.58 18.16,40.74 DD2.8 18.16,42.84 v14,47 8.84,41.84 8.84,30.9 9.75,29.98 9.98,29.98 v10,30 | v57,86 v57,81 v57,78 | v25,71 v25,79 | U4.8 50,68.94 v50,70 | C9.- C10.- 61.42,34.36 DD1.7 | v38,100 v36,102 | v68,52 70.47,54.47 R11.2
H  (via drill 0.35)
  Top 0.813: U4.12 55.23,72.77 58,70 v58,66 | DD1.1 64.46,50 57.6,50 | R7.1 58.6,47.56 58.6,49 57.6,50 | 57.6,50 56,51.6 56,53.27 58.97,56.23 58.97,60.97 v61,63
  Bottom 0.813: v58,66 60,66 60.03,65.97 60.4,65.97 60.97,65.4 60.97,63.03 v61,63
H_HDMI  (via drill 0.35)
  Top 0.3: U8.43 45.98,25.97 45,26.95 v45,28
  Bottom 0.813: U3.14 38.48,77.84 40,76.32 40,33 v45,28
HDMI_1
  Top 0.3: U8.11 41.19,17.77 39.97,16.55 30.02,16.55 29.84,16.36 12.23,16.36 10.97,17.63 XS4.P$1
HDMI_3
  Top 0.3: U8.10 41.05,18.27 39.78,17 29.83,17 29.65,16.82 12.46,16.82 10.64,18.63 XS4.P$3
HDMI_4
  Top 0.3: U8.8 40.71,19.27 40.2,18.77 29.85,18.77 29.51,18.43 11.5,18.43 10.79,19.13 XS4.P$4
HDMI_6
  Top 0.3: U8.7 40.57,19.77 40.02,19.22 29.66,19.22 29.32,18.88 11.7,18.88 10.45,20.13 XS4.P$6
HDMI_7
  Top 0.3: U8.5 29.41,20.77 29.16,20.52 10.7,20.52 10.6,20.63 XS4.P$7
HDMI_9
  Top 0.3: U8.4 29.27,21.27 28.98,20.98 24.77,20.98 24.75,21 10.93,21 10.29,21.63 XS4.P$9
HDMI_10
  Top 0.3: U8.2 40.98,22.27 40.58,22.67 10.86,22.67 10.32,22.13 XS4.P$10
HDMI_12
  Top 0.3: U8.1 41.13,22.77 40.77,23.13 XS4.P$12
HDMI_15
  Top 0.3: U8.46 44.48,25.52 42.7,27.3 37.22,27.3 34.55,24.63 XS4.P$15
HDMI_16
  Top 0.3: U8.45 44.98,25.66 42.89,27.75 36.88,27.75 34.26,25.13 XS4.P$16
HDMI_18
  Top 0.3: U8.44 45.48,25.8 43.08,28.2 36.69,28.2 34.62,26.14 XS4.P$18
HDMI_19
  Top 0.3: XS4.P$19 8.88,26.62 10.28,26.62 11,27.34 11,40 | 11,40 11,41 12.03,42.03 R22.2 | R23.1 13,40 12.45,40.55 11.55,40.55 11,40
HIGH  (via drill 0.35)
  Top 0.7: U7.6 56.05,61.95 57,61
  Top 0.813: DD2.2 20.7,32.04 23.23,34.57 v24.15,34.57 | v39,39 v45,45 57,57 57,61 57,62 59,64 59,82 56,85 47,85 46.21,84.21 U4.1
  Bottom 0.813: v24.15,34.57 v24.16,34.56 28.54,34.56 32.98,39 v39,39 | v45,45 45,39.37 60.23,24.13 60.23,15.12 60.95,14.41 65.65,14.41 66.53,15.29 DD4.3
LED1
  Top 0.61: R28.2 71.62,8.62 70,7 36,7 32.1,10.9 17.86,10.9 16.91,9.95 12.6,9.95 11,8.35 HL1.C
LED2
  Top 0.61: R29.2 74.17,9.25 70.92,6 35,6 31.05,9.95 18.4,9.95 17,8.55 HL2.C
LED3
  Top 0.61: R30.2 76.7,10.7 71,5 34,5 31,8 23.75,8 HL3.C
LOW  (via drill 0.35)
  Top 0.7: v43,61.95 U6.6
  Top 0.813: DD2.3 23.24,32.44 24.1,33.3 v25.05,33.3 | v38,38 38,39.37 v45.82,47.18 45.82,59.18 v45,60
  Bottom 0.813: v25.05,33.3 28.64,33.3 33.34,38 v38,38 | v45,60 44.95,60 v43,61.95 43,79.14 37.99,84.14 35.66,84.14 34.45,82.92 U3.1 | v45.82,47.18 46,47 46,39.73 59.94,25.79 61.95,25.79 62.77,24.97 62.77,22.75 63.99,21.52 DD4.2
N$1
  Top 0.813: VD1.C FU1.1
N$2
  Top 0.813: R7.2 61.75,47.06 | 61.75,47.06 DD1.2 | C9.+ 60.88,46.19 61.75,47.06
N$3
  Top 0.813: U1.6 64.16,119.31 | 64.16,119.31 C2.1 | VD2.C 64.16,117.51 | 64.16,119.31 64.16,117.51 | 64.16,117.51 64.16,113.64 L1.1
N$4
  Top 0.813: R8.2 61.7,39.44 | 61.7,39.44 DD1.5 | C10.+ 60.88,38.62 61.7,39.44
N$5
  Top 0.813: C2.2 71.78,119.45 U1.1
N$6
  Top 0.813: U1.3 74.76,126.21 | 74.76,126.21 R2.1 | 74.76,126.21 78.75,126.21 R3.2
N$7
  Top 0.813: R1.2 60.79,125.25 61.79,126.25 64.12,126.25 U1.4
N$8
  Top 0.813: C6.1 64.19,97.43 | 64.19,97.43 U2.6 | L2.1 64.19,91.78 64.19,95.26 | 64.19,95.26 62.95,94.02 VD3.C | 64.19,97.43 64.19,95.26
N$9
  Top 0.813: C6.2 71.81,97.51 U2.1
N$10
  Top 0.813: U2.3 74.68,104.52 | 74.68,104.52 R5.1 | 74.68,104.52 78.99,104.52 R6.2
N$11
  Top 0.61: R28.1 DD4.5
N$12
  Top 0.813: R4.2 60.93,103.26 62.19,104.52 U2.4
N$13
  Top 0.813: C11.2 U5.2
N$14
  Top 0.813: DD1.3 66.08,44.52 69.6,41 69.6,34.85 71.31,33.14 73.64,33.14 74.36,33.85 74.36,36.02 73.47,36.9 DD1.9
N$15
  Bottom 0.813: DD1.6 67.4,36.9 69.94,39.44 DD1.10
N$16
  Top 0.813: C12.2 U5.3
N$17
  Top 0.813: DD1.8 70.6,36.24 70.6,42.64 DD1.12
N$18
  Bottom 0.813: DD1.11 72.5,42 75,42 77,44 77,47.7 79.2,49.9 80.84,49.9 R12.1
N$19
  Top 0.813: R9.3 85.07,71.07 88.49,67.65 C11.1
N$20
  Top 0.813: R10.3 85.07,66.93 87,65 89.47,65 C12.1
N$22
  Top 0.813: R11.3 85.02,58.92 88.65,62.55 C13.1
N$23
  Top 0.813: C13.2 U5.4
N$24
  Top 0.813: R12.3 95.27,47.34 U5.10
N$25
  Top 0.813: R16.2 109.12,31 | 109.12,31 109.12,26 | 109.12,26 VT1.C | C23.1 107.85,29.73 109.12,31 | R17.2 108.04,24.92 109.12,26
N$26
  Top 0.813: 89.13,28.13 90,29 91.4,29 R19.1 93.56,29.72 Q1.2 C23.2 | 89.13,28.13 C25.2 | R18.1 96.94,14.57 95.4,13.04 90.97,13.04 87,17 87,26 89.13,28.13
N$27
  Top 0.813: C24.1 96.07,24.8 Q1.1 | Q1.1 96.19,24.92 R17.1 102,23.75 102,22 103.37,20.63 VT1.B | Q1.1 93.6,24.9 R19.2
N$28
  Top 0.813: C25.1 89.13,16.87 92,14 95,14 96.07,15.07 C24.2 103.79,15.78 105,14.57 | R18.2 105,14.57 | 105,14.57 106.57,14.57 110.07,18.07 | 110.07,18.07 VT1.E | C18.2 113.02,21.02 110.07,18.07
N$29  (via drill 0.35)
  Top 0.813: v111.06,30 112.42,30 113.02,29.4 C18.1
  Bottom 0.813: v111.06,30 108,30 106,32 100,32 93.41,38.59 93.41,56.59 94.3,57.48 U5.6
N$30
  Top 0.61: R29.1 74.17,16.27 DD4.6
N$31
  Top 0.813: U5.9 93.07,49.86 C14.1
N$32
  Top 0.61: R30.1 DD4.7
N$33
  Top 0.813: U5.13 108.29,42.24 109.51,41.02 | 109.51,41.02 R15.1 | C17.+ 109.51,38.17 109.51,41.02
N$34
  Top 0.813: U5.14 107.45,44.78 108.67,46 C16.+
N$35
  Top 0.813: R14.1 110.54,51.97 107.57,54.94 U5.18
N$36
  Top 0.813: U5.20 105.47,60 108,60 110,62 110,64.5 R13.1
N$37
  Top 0.7: U6.4 43.05,60.05 44.95,61.95 U7.1
N$38
  Top 0.813: C15.+ R13.2
N$39
  Top 0.813: U3.4 30.26,75.3 31.51,76.55 43.96,76.55 45.26,77.85 U4.3
N$40
  Top 0.813: U3.7 30.21,67.68 31.53,69 43.95,69 45.18,70.23 U4.6
N$41
  Top 0.813: U3.9 43.81,65.14 45.05,66.37 51.46,66.37 52.78,67.69 U4.10
N$42
  Top 0.3: C32.1 42.97,25.98 43.48,25.47 U8.48
N$43
  Top 0.813: U3.12 43.81,72.76 45.05,73.99 48.94,73.99 52.8,77.85 U4.14
N$48
  Top 0.3: U8.15 R26.2
N$49
  Top 0.3: U8.35 52.27,22.27 53,23 53,23.5 R27.1
N$61  (via drill 0.35)
  Top 0.3: U8.31 54.23,20.27 55,21.04 55,27 52.55,29.45 33.08,29.45 28.15,34.38 v28.15,35.5
  Top 0.813: R20.2 23.22,38.88 DD2.6
  Bottom 0.3: v28.15,35.5 25.8,35.5 23.24,38.06 DD2.6
  Bottom 0.813: DD3.6 25.04,46.26 23.24,44.46 DD2.6
N$63
  Top 0.3: DD2.5 25.93,38.71 25.93,35.96 32.9,29 45.6,29 46,28.6 46,26.59 46.48,26.11 U8.42
  Top 0.813: DD2.5 25.78,46.88 | DD3.5 27.7,48.8 25.78,46.88 | 25.78,46.88 25.78,49.59 R21.2
N$65
  Top 0.813: DD2.7 17.53,42.03 R22.1
N$68
  Top 0.813: R24.2 24.36,28.02 25.78,29.44 DD2.4
N$69  (via drill 0.35)
  Top 0.813: R24.1 14.05,28 v12,28 | v10,31.15 9.99,31.16 7.29,31.16 6,29.88 6,13 | 6,13 5.16,12.16 3.78,12.16 2.79,11.17 2.79,10.04 SB1.1 | R25.1 6.99,12.01 6,13
  Bottom 0.813: v12,28 12,30 10.85,31.15 v10,31.15
R  (via drill 0.35)
  Top 0.813: v58,79 55.06,79 54.99,79.07 49.97,79.07 U4.4 | v60,79 67,79 71.54,83.54 R9.1
  Bottom 0.813: v58,79 v60,79
R_HDMI  (via drill 0.35)
  Top 0.3: U8.39 47.98,25 49,26.02 49,27 v48,28
  Bottom 0.813: v48,28 40.97,35.03 40.97,76.72 38.63,79.06 30.43,79.06 U3.3
RCA
  Top 0.813: XS5.1 111,79 109.97,77.97 C15.-
V  (via drill 0.35)
  Top 0.7: U7.4 55.96,60.04 v56,60
  Top 0.813: DD1.4 57.62,41.98 | 57.62,41.98 55.62,41.98 52,45.6 52,50.63 57.97,56.6 57.97,59.97 v58,60 | R8.1 58.6,39.94 58.6,41 57.62,41.98
  Bottom 0.7: v56,60 v58,60
V_HDMI  (via drill 0.35)
  Top 0.3: U8.30 54.77,19.77 v56,21
  Top 0.7: U6.1 27.95,61.95 27,61 27,56.45 31.45,52 v44,52
  Bottom 0.813: v56,21 56,27 44,39 v44,52
VGA_1
  Bottom 0.813: XS2.1 29.99,95.66 45.26,80.39 U4.2
VGA_2
  Bottom 0.813: XS2.2 33.58,97.95 48.09,83.44 48.09,73.65 47.21,72.77 U4.5
VGA_3
  Bottom 0.813: XS2.3 32.66,100.24 49.95,82.95 49.95,72.26 51.98,70.23 U4.11
VGA_13
  Bottom 0.813: XS2.13 2.36,100.24 1.48,101.13 1.48,105.88 2.88,107.28 29.04,107.28 51.95,84.36 51.95,76.19 52.83,75.31 U4.13
VGA_14  (via drill 0.35)
  Top 0.7: v46.8,60.1 46.86,60.04 U7.3
  Bottom 0.7: XS2.14 3.39,102.53 2.48,103.44 2.48,105.4 3.3,106.22 28.78,106.22 51.04,83.96 51.04,73.25 52.69,71.61 54.76,71.61 56,70.36 56,64 55,63 47.3,63 46.05,61.75 46.05,60.85 v46.8,60.1